# EAGLE design anvil_debug_v2 (EAGLE 6.4)
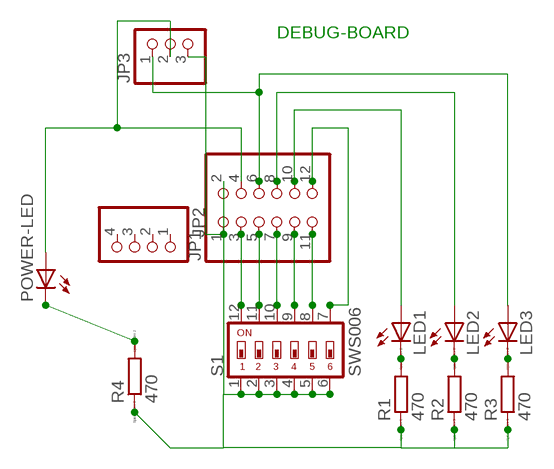
[diagram p0: schematic, sheet 1]

## Parts
JP1  PINHD-2X6  [2X06]
JP2  PINHD-1X4  [1X04]
JP3  PINHD-1X3  [1X03]
LED1  LEDSMT1206  [1206]
LED2  LEDSMT1206  [1206]
LED3  LEDSMT1206  [1206]
POWER-LED  LEDSMT1206  [1206]
R1  470  RR1206  [R1206]
R2  470  RR1206  [R1206]
R3  470  RR1206  [R1206]
R4  470  RR1206  [R1206]
S1  SWS006  [SMS-006]

## Nets
N$1: LED1.C R1.2
N$2: LED2.C R2.2
N$3: LED3.C R3.2
N$4: JP1.3 S1.12
N$5: JP1.5 S1.11
N$6: JP1.7 S1.10
N$7: JP1.9 S1.9
N$8: JP1.11 S1.8
N$9: JP1.12 S1.7
N$10: JP1.10 LED1.A
N$11: JP1.8 LED2.A
N$12: JP1.1 JP1.2 JP3.3 R1.1 R2.1 R3.1 R4.1 S1.1 S1.2 S1.3 S1.4 S1.5 S1.6
N$13: JP1.6 JP3.1 LED3.A
N$14: POWER-LED.C R4.2
N$15: JP1.4 JP3.2 POWER-LED.A
Unconnected: JP2.1 JP2.2 JP2.3 JP2.4

## Notes on the sheet
- DEBUG-BOARD

## Library data of the parts
JP1 = pinhead:PINHD-2X6: PIN HEADER
JP2 = pinhead:PINHD-1X4: PIN HEADER
JP3 = pinhead:PINHD-1X3: PIN HEADER
LED1-LED3 POWER-LED = led:LED: LED OSRAM: - CHIPLED LG R971, LG N971, LY N971, LG Q971, LY Q971, LO R971, LY R971 LH N974, LH R974 LS Q976, LO Q976, LY Q976 LO Q996 - Hyper CHIPLED LW Q18S LB Q993, LB Q99A, LB R99A - SideLED LS A670, LO A670, LY A670, LG A670, LP A670 LB A673, LV A673, LT A673, LW A673 LH A674 LY A675 LS A676, LA A676, LO A676, LY A676, LW A676 LS A679, LY A679, LG A679 - Hyper Micro SIDELED® LS Y876, LA Y876, LO Y876, LY Y876 LT Y87S - SmartLED LW L88C, LW L88S LB L89C, LB L89S, LG L890 LS L89K, LO L89K, LY L89K LS L896, LA L896, LO L896, LY L896 - TOPLED LS T670, LO T670, LY T670, LG T670, LP T670 LSG T670, LSP T670, LSY T670, LOP T670, LYG T670 LG T671, LOG T671, LSG T671 LB T673, LV T673, LT T673, LW T673 LH T674 LS T676, LA T676, LO T676, LY T676, LB T676, LH T676, LSB T676, LW T676 LB T67C, LV T67C, LT T67C, LS T67K, LO T67K, LY T67K, LW E67C LS E67B, LA E67B, LO E67B, LY E67B, LB E67C, LV E67C, LT E67C LW T67C LS T679, LY T679, LG T679 LS T770, LO T770, LY T770, LG T770, LP T770 LB T773, LV T773, LT T773, LW T773 LH T774 LS E675, LA E675, LY E675, LS T675 LS T776, LA T776, LO T776, LY T776, LB T776 LHGB T686 LT T68C, LB T68C - Hyper Mini TOPLED® LB M676 - Mini TOPLED Santana® LG M470 LS M47K, LO M47K, LY M47K Source: http://www.osram.convergy.de LUXEON: - LUMILED® LXK2-PW12-R00, LXK2-PW12-S00, LXK2-PW14-U00, LXK2-PW14-V00 LXK2-PM12-R00, LXK2-PM12-S00, LXK2-PM14-U00 LXK2-PE12-Q00, LXK2-PE12-R00, LXK2-PE12-S00, LXK2-PE14-T00, LXK2-PE14-U00 LXK2-PB12-K00, LXK2-PB12-L00, LXK2-PB12-M00, LXK2-PB14-N00, LXK2-PB14-P00, LXK2-PB14-Q00 LXK2-PR12-L00, LXK2-PR12-M00, LXK2-PR14-Q00, LXK2-PR14-R00 LXK2-PD12-Q00, LXK2-PD12-R00, LXK2-PD12-S00 LXK2-PH12-R00, LXK2-PH12-S00 LXK2-PL12-P00, LXK2-PL12-Q00, LXK2-PL12-R00 Source: www.luxeon.com KINGBRIGHT: KA-3528ASYC Source: www.kingbright.com
R1-R4 = eagle-ltspice:R: RESISTOR, European symbol; SPICEMODEL: NONE; SPICEPREFIX: R
S1 = smd-special:SWS006: SMD Dip Switch 6 pol.

## Board
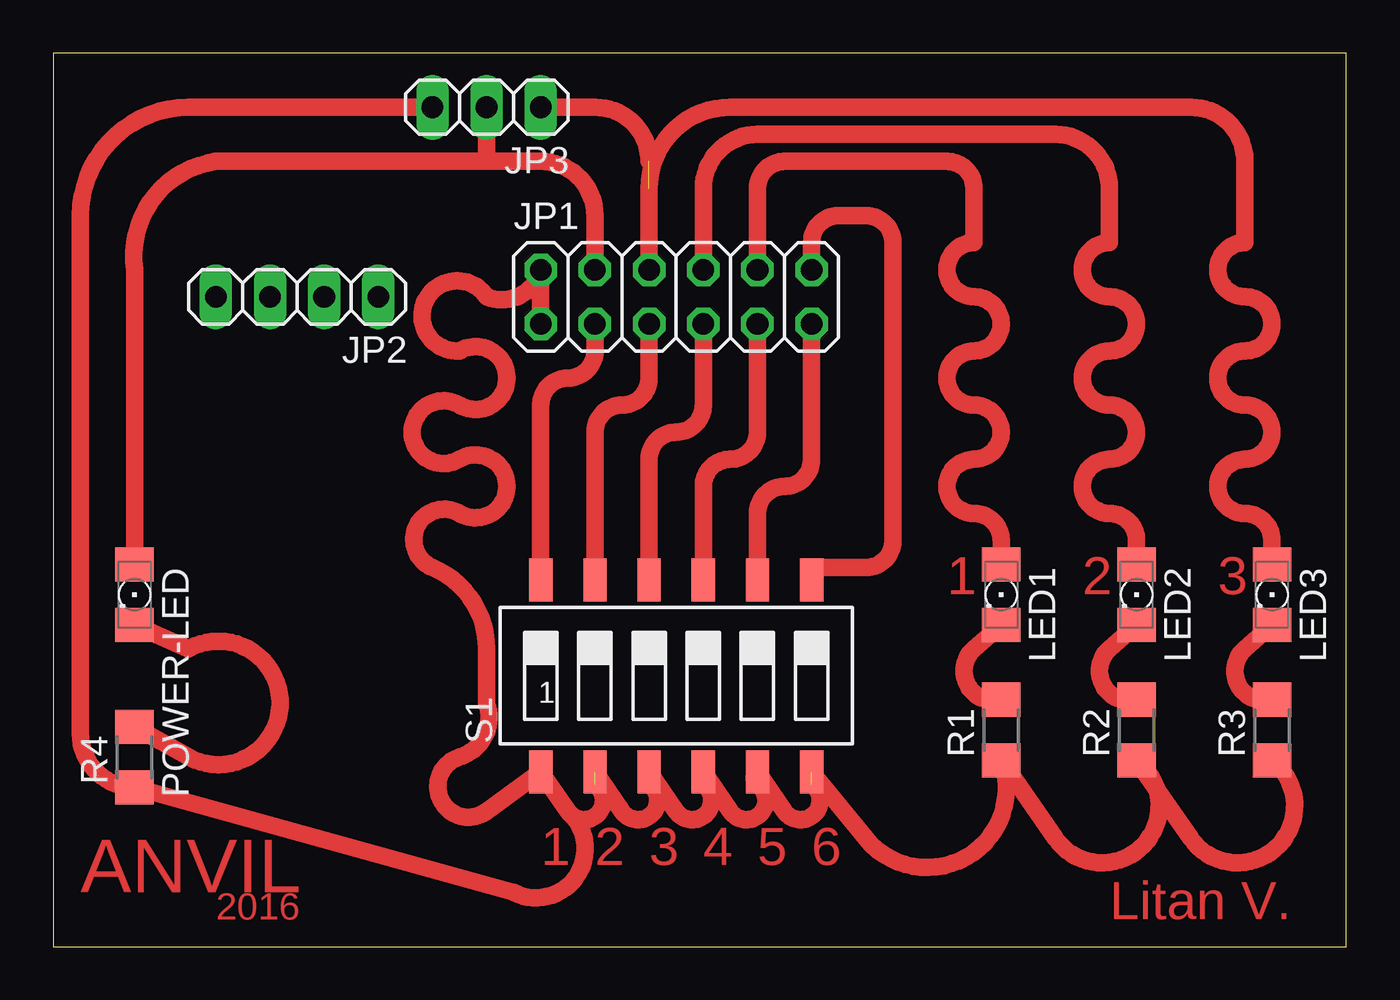
[diagram p1: board, top side]

Size 60.63 x 41.9 mm. Coordinates in mm from the lower left corner, seen from the top.
Outline: 0,0 60.63,0 60.63,41.9 0,41.9 0,0
Copper layers (1*16): Top 0.035mm / dielectric 1.5mm / Bottom 0.035mm
Design rules "default": minimum track width 10mil, minimum drill 24mil, track to track 8mil, track to pad 8mil, pad to pad 8mil, via to via 8mil, smd to smd 8mil, copper to edge 40mil, drill to drill 8mil, minimum pad ring 10mil, minimum via ring 8mil, stop-mask expansion 4mil, vias tented up to drill 0mil, thermal gap 10mil

### Footprints (pad centres in the part's own frame; a part is rotated, then mirrored left to right if it is on the bottom)
2X06 = drill 1.016 octagon: 1 -6.35,-1.27; 2 -6.35,1.27; 3 -3.81,-1.27; 4 -3.81,1.27; 5 -1.27,-1.27; 6 -1.27,1.27; 7 1.27,-1.27; 8 1.27,1.27; 9 3.81,-1.27; 10 3.81,1.27; 11 6.35,-1.27; 12 6.35,1.27
1X04 = drill 1.016 long: 1 -3.81,0; 2 -1.27,0; 3 1.27,0; 4 3.81,0
1X03 = drill 1.016 long: 1 -2.54,0; 2 0,0; 3 2.54,0
1206 = smd 1.6 x 1.803: A -1.422,0; C 1.422,0
R1206 = smd 1.6 x 1.803: 1 -1.422,0; 2 1.422,0
SMS-006 = smd 1.092 x 2.007: 1 -6.35,-4.496; 2 -3.81,-4.496; 3 -1.27,-4.496; 4 1.27,-4.496; 5 3.81,-4.496; 6 6.35,-4.496; 7 6.35,4.496; 8 3.81,4.496; 9 1.27,4.496; 10 -1.27,4.496; 11 -3.81,4.496; 12 -6.35,4.496

### Placement (x,y rotation side)
JP1  29.21,30.48 0 top
JP2  11.43,30.48 180 top
JP3  20.32,39.37 180 top
LED1  44.45,16.51 270 top
LED2  50.8,16.51 270 top
LED3  57.15,16.51 270 top
POWER-LED  3.81,16.51 270 top
R1  44.45,10.16 90 top
R2  50.8,10.16 90 top
R3  57.15,10.16 90 top
R4  3.81,8.89 90 top
S1  29.21,12.7 0 top

### Tracks (layer width: path | path; a pad name or v marks a point on that pad's centre or on a via)
N$1
  Top 0.813: LED1.C 43.18,13.97 arc153 R1.2
N$2
  Top 0.813: LED2.C 49.53,13.97 arc153 R2.2
N$3
  Top 0.813: LED3.C 55.88,13.97 arc153 R3.2
N$4
  Top 0.813: S1.12 22.86,25.4 arc-90 24.13,26.67 arc90 25.4,27.94 JP1.3
N$5
  Top 0.813: S1.11 25.4,24.13 arc-90 26.67,25.4 arc90 27.94,26.67 JP1.5
N$6
  Top 0.813: S1.10 27.94,22.86 arc-90 29.21,24.13 arc90 30.48,25.4 JP1.7
N$7
  Top 0.813: S1.9 30.48,21.59 arc-90 31.75,22.86 arc90 33.02,24.13 JP1.9
N$8
  Top 0.813: S1.8 33.02,20.32 arc-90 34.29,21.59 arc90 35.56,22.86 JP1.11
N$9
  Top 0.813: JP1.12 35.56,33.02 arc-90 36.83,34.29 38.1,34.29 arc-90 39.37,33.02 39.37,19.05 arc-90 38.1,17.78 35.56,17.78 S1.7
N$10
  Top 0.813: LED1.A 44.45,19.05 arc90 43.18,20.32 arc-180 43.18,22.86 arc180 43.18,25.4 arc-180 43.18,27.94 arc180 43.18,30.48 arc-180 43.18,33.02 43.18,35.56 arc90 41.91,36.83 34.29,36.83 arc90 33.02,35.56 JP1.10
N$11
  Top 0.813: LED2.A 50.8,19.05 arc90 49.53,20.32 arc-180 49.53,22.86 arc180 49.53,25.4 arc-180 49.53,27.94 arc180 49.53,30.48 arc-180 49.53,33.02 49.53,35.56 arc90 46.99,38.1 33.02,38.1 arc90 30.48,35.56 JP1.8
N$12  (2 unrouted)
  Top 0.813: 35.56,7.62 arc-201 34.29,6.35 S1.5 arc111 33.02,7.62 arc-201 31.75,6.35 S1.4 arc111 30.48,7.62 arc-201 29.21,6.35 S1.3 arc111 27.94,7.62 arc-201 26.67,6.35 S1.2 | 24.13,6.35 S1.1 20.32,6.35 arc-199 19.05,8.89 arc93 20.32,11.43 20.32,13.97 arc67 17.78,17.78 arc-188 19.05,20.32 arc241 19.05,22.86 arc-241 19.05,25.4 arc241 19.05,27.94 arc-241 20.32,30.48 arc98 JP1.2 JP1.1 | 24.13,6.35 arc201 25.4,7.62 | 24.13,6.35 arc-167 21.59,2.54 R4.1 arc-90 1.27,10.01 1.27,34.29 arc-90 6.35,39.37 JP3.3 | R3.1 arc-198 53.34,5.08 R2.1 arc-198 46.99,5.08 R1.1 arc-162 38.1,5.08 S1.6
N$13  (1 unrouted)
  Top 0.813: LED3.A 57.15,19.05 arc90 55.88,20.32 arc-180 55.88,22.86 arc180 55.88,25.4 arc-180 55.88,27.94 arc180 55.88,30.48 arc-180 55.88,33.02 55.88,36.83 arc90 53.34,39.37 31.75,39.37 arc90 27.94,35.56 JP1.6 | JP3.1 25.4,39.37 arc-90 27.94,36.83
N$14
  Top 0.813: POWER-LED.C 6.35,13.97 arc-237 6.35,8.89 R4.2
N$15
  Top 0.813: 20.32,36.83 15.24,36.83 7.62,36.83 arc90 3.81,31.75 POWER-LED.A | 20.32,36.83 22.86,36.83 arc-90 25.4,34.29 JP1.4 | JP3.2 20.32,36.83
N$16
  Top 0.813: 50.8,19.05 arc90 49.53,20.32 arc-180 49.53,22.86 arc180 49.53,25.4 arc-180 49.53,27.94 arc180 49.53,30.48 arc-180 49.53,33.02 49.53,34.29
N$17
  Top 0.813: 57.15,19.05 arc90 55.88,20.32 arc-180 55.88,22.86 arc180 55.88,25.4 arc-180 55.88,27.94 arc180 55.88,30.48 arc-180 55.88,33.02

### Text on the board
Top: 1 | 2 | 3 | 1 | 2 | 3 | 4 | 5 | 6 | ANVIL | 2016 | Litan V.